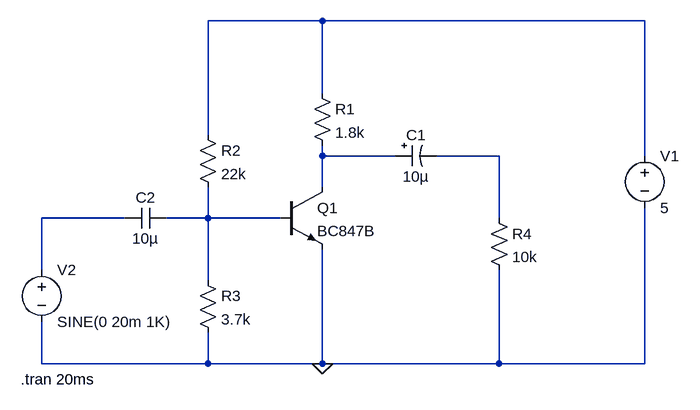
[diagram p0: schematic simulation.asc]
simulation.asc, the LTspice schematic file:
Version 4
SHEET 1 880 680
WIRE 272 -144 96 -144
WIRE 768 -144 272 -144
WIRE 272 -32 272 -144
WIRE 96 32 96 -144
WIRE 272 64 272 48
WIRE 384 64 272 64
WIRE 544 64 448 64
WIRE 768 64 768 -144
WIRE 272 112 272 64
WIRE -32 160 -160 160
WIRE 96 160 96 112
WIRE 96 160 32 160
WIRE 208 160 96 160
WIRE 544 160 544 64
WIRE -160 240 -160 160
WIRE 96 256 96 160
WIRE -160 384 -160 320
WIRE 96 384 96 336
WIRE 96 384 -160 384
WIRE 272 384 272 208
WIRE 272 384 96 384
WIRE 544 384 544 240
WIRE 544 384 272 384
WIRE 768 384 768 144
WIRE 768 384 544 384
FLAG 272 384 0
SYMBOL npn 208 112 R0
SYMATTR InstName Q1
SYMATTR Value BC847B
SYMBOL res 256 -48 R0
SYMATTR InstName R1
SYMATTR Value 1.8k
SYMBOL res 80 16 R0
SYMATTR InstName R2
SYMATTR Value 22k
SYMBOL res 80 240 R0
SYMATTR InstName R3
SYMATTR Value 3.7k
SYMBOL polcap 384 48 M90
WINDOW 0 0 32 VBottom 2
WINDOW 3 32 32 VTop 2
SYMATTR InstName C1
SYMATTR Value 10µ
SYMATTR Description Capacitor
SYMATTR Type cap
SYMATTR SpiceLine V=16 Irms=2.62 Rser=0.022 Lser=0
SYMBOL voltage 768 48 R0
WINDOW 123 0 0 Left 2
WINDOW 39 0 0 Left 2
SYMATTR InstName V1
SYMATTR Value 5
SYMBOL res 528 144 R0
SYMATTR InstName R4
SYMATTR Value 10k
SYMBOL cap 32 144 R90
WINDOW 0 0 32 VBottom 2
WINDOW 3 32 32 VTop 2
SYMATTR InstName C2
SYMATTR Value 10µ
SYMBOL voltage -160 224 R0
WINDOW 123 0 0 Left 2
WINDOW 39 0 0 Left 2
SYMATTR InstName V2
SYMATTR Value SINE(0 20m 1K)
TEXT -192 408 Left 2 !.tran 20ms

The netlist it stands for:
* simulation.asc
Q1 N002 N005 0 0 BC847B
R1 N001 N002 1.8k
R2 N001 N005 22k
R3 N005 0 3.7k
C1 N002 N003 10µ V=16 Irms=2.62 Rser=0.022 Lser=0
V1 N001 0 5
R4 N003 0 10k
C2 N005 N004 10µ
V2 N004 0 SINE(0 20m 1K)
.model NPN NPN
.model PNP PNP
.lib standard.bjt
.tran 20ms
.backanno
.end